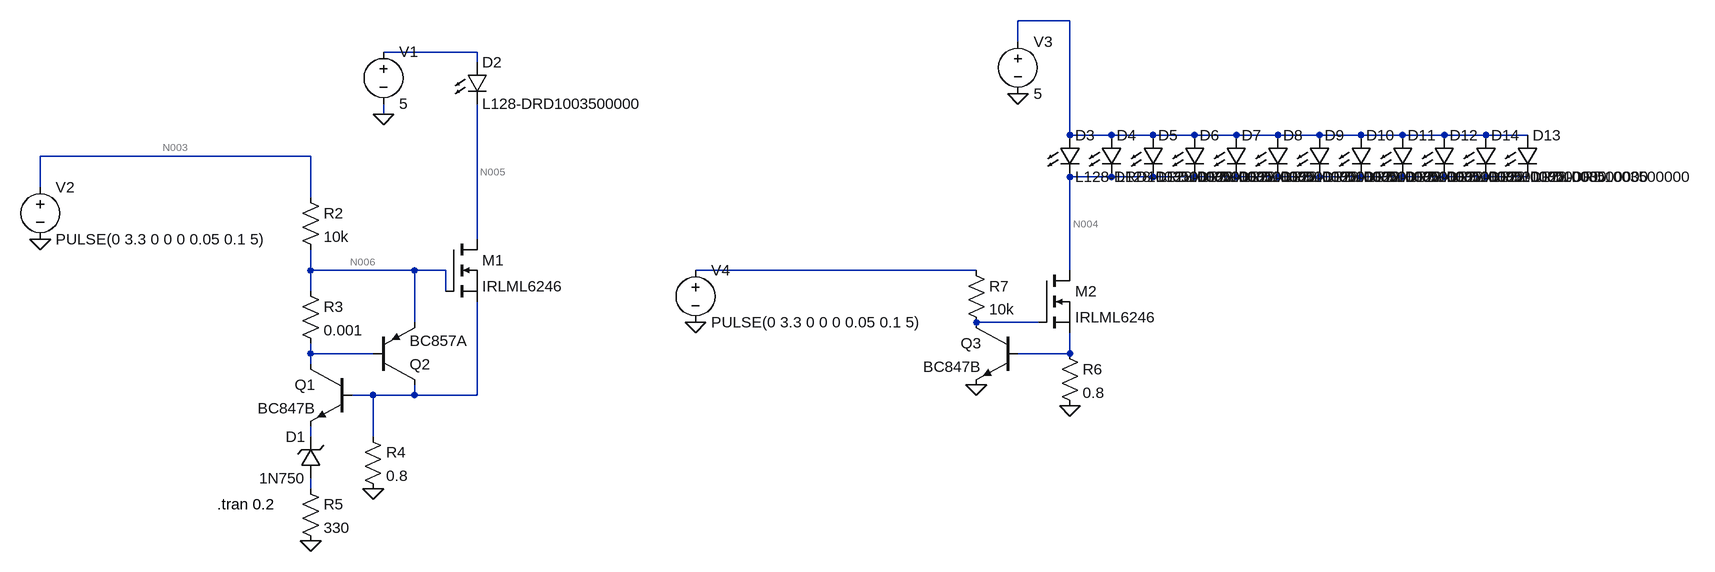
[diagram p0: schematic MOSFET.asc]
MOSFET.asc, the LTspice schematic file:
Version 4
SHEET 1 2644 680
WIRE 1408 -512 1328 -512
WIRE 1328 -480 1328 -512
WIRE 496 -464 352 -464
WIRE 496 -448 496 -464
WIRE 352 -368 352 -384
WIRE 1408 -336 1408 -512
WIRE 1472 -336 1408 -336
WIRE 1536 -336 1472 -336
WIRE 1600 -336 1536 -336
WIRE 1664 -336 1600 -336
WIRE 1728 -336 1664 -336
WIRE 1792 -336 1728 -336
WIRE 1856 -336 1792 -336
WIRE 1920 -336 1856 -336
WIRE 1984 -336 1920 -336
WIRE 2048 -336 1984 -336
WIRE 2112 -336 2048 -336
WIRE 240 -304 -176 -304
WIRE 1472 -272 1408 -272
WIRE 1536 -272 1472 -272
WIRE 1600 -272 1536 -272
WIRE 1664 -272 1600 -272
WIRE 1728 -272 1664 -272
WIRE 1792 -272 1728 -272
WIRE 1856 -272 1792 -272
WIRE 1920 -272 1856 -272
WIRE 1984 -272 1920 -272
WIRE 2048 -272 1984 -272
WIRE 2112 -272 2048 -272
WIRE -176 -256 -176 -304
WIRE 240 -240 240 -304
WIRE 496 -176 496 -384
WIRE 240 -128 240 -160
WIRE 400 -128 240 -128
WIRE 448 -128 400 -128
WIRE 1264 -128 832 -128
WIRE 1408 -128 1408 -272
WIRE 240 -96 240 -128
WIRE 448 -96 448 -128
WIRE 400 -48 400 -128
WIRE 1360 -48 1264 -48
WIRE 240 0 240 -16
WIRE 336 0 240 0
WIRE 1408 0 1408 -32
WIRE 1408 0 1328 0
WIRE 240 16 240 0
WIRE 336 64 304 64
WIRE 400 64 400 48
WIRE 400 64 336 64
WIRE 496 64 496 -80
WIRE 496 64 400 64
WIRE 240 128 240 112
WIRE 336 128 336 64
WIRE 240 208 240 192
FLAG 352 -368 0
FLAG -176 -176 0
FLAG 336 208 0
FLAG 240 288 0
FLAG 1328 -400 0
FLAG 1408 80 0
FLAG 1264 48 0
FLAG 832 -48 0
SYMBOL npn 304 16 M0
SYMATTR InstName Q1
SYMATTR Value BC847B
SYMBOL pnp 336 48 M180
SYMATTR InstName Q2
SYMATTR Value BC857A
SYMBOL nmos 448 -176 R0
SYMATTR InstName M1
SYMATTR Value IRLML6246
SYMBOL res 224 -256 R0
SYMATTR InstName R2
SYMATTR Value 10k
SYMATTR SpiceLine tol=1
SYMBOL res 224 -112 R0
SYMATTR InstName R3
SYMATTR Value 0.001
SYMATTR SpiceLine tol=1
SYMBOL res 320 112 R0
SYMATTR InstName R4
SYMATTR Value 0.8
SYMATTR SpiceLine tol=1
SYMBOL voltage 352 -480 R0
WINDOW 123 0 0 Left 0
WINDOW 39 0 0 Left 0
SYMATTR InstName V1
SYMATTR Value 5
SYMBOL voltage -176 -272 R0
WINDOW 123 0 0 Left 0
WINDOW 39 0 0 Left 0
SYMATTR InstName V2
SYMATTR Value PULSE(0 3.3 0 0 0 0.05 0.1 5)
SYMBOL res 224 192 R0
SYMATTR InstName R5
SYMATTR Value 330
SYMATTR SpiceLine tol=1
SYMBOL voltage 1328 -496 R0
WINDOW 123 0 0 Left 0
WINDOW 39 0 0 Left 0
SYMATTR InstName V3
SYMATTR Value 5
SYMBOL voltage 832 -144 R0
WINDOW 123 0 0 Left 0
WINDOW 39 0 0 Left 0
SYMATTR InstName V4
SYMATTR Value PULSE(0 3.3 0 0 0 0.05 0.1 5)
SYMBOL nmos 1360 -128 R0
SYMATTR InstName M2
SYMATTR Value IRLML6246
SYMBOL npn 1328 -48 M0
SYMATTR InstName Q3
SYMATTR Value BC847B
SYMBOL res 1392 -16 R0
SYMATTR InstName R6
SYMATTR Value 0.8
SYMATTR SpiceLine tol=5
SYMBOL res 1248 -144 R0
SYMATTR InstName R7
SYMATTR Value 10k
SYMATTR SpiceLine tol=1
SYMBOL LED 1392 -336 R0
SYMATTR InstName D3
SYMATTR Value L128-DRD1003500000
SYMATTR Description Diode
SYMATTR Type diode
SYMBOL LED 1456 -336 R0
SYMATTR InstName D4
SYMATTR Value L128-DRD1003500000
SYMATTR Description Diode
SYMATTR Type diode
SYMBOL LED 1520 -336 R0
SYMATTR InstName D5
SYMATTR Value L128-DRD1003500000
SYMATTR Description Diode
SYMATTR Type diode
SYMBOL LED 1584 -336 R0
SYMATTR InstName D6
SYMATTR Value L128-DRD1003500000
SYMATTR Description Diode
SYMATTR Type diode
SYMBOL LED 1648 -336 R0
SYMATTR InstName D7
SYMATTR Value L128-DRD1003500000
SYMATTR Description Diode
SYMATTR Type diode
SYMBOL LED 1712 -336 R0
SYMATTR InstName D8
SYMATTR Value L128-DRD1003500000
SYMATTR Description Diode
SYMATTR Type diode
SYMBOL LED 1776 -336 R0
SYMATTR InstName D9
SYMATTR Value L128-DRD1003500000
SYMATTR Description Diode
SYMATTR Type diode
SYMBOL LED 1840 -336 R0
SYMATTR InstName D10
SYMATTR Value L128-DRD1003500000
SYMATTR Description Diode
SYMATTR Type diode
SYMBOL LED 1904 -336 R0
SYMATTR InstName D11
SYMATTR Value L128-DRD1003500000
SYMATTR Description Diode
SYMATTR Type diode
SYMBOL LED 1968 -336 R0
SYMATTR InstName D12
SYMATTR Value L128-DRD1003500000
SYMATTR Description Diode
SYMATTR Type diode
SYMBOL LED 2096 -336 R0
SYMATTR InstName D13
SYMATTR Value L128-DRD1003500000
SYMATTR Description Diode
SYMATTR Type diode
SYMBOL zener 256 192 R180
WINDOW 0 24 64 Left 2
WINDOW 3 24 0 Left 2
SYMATTR InstName D1
SYMATTR Value 1N750
SYMBOL LED 480 -448 R0
SYMATTR InstName D2
SYMATTR Value L128-DRD1003500000
SYMATTR Description Diode
SYMATTR Type diode
SYMBOL LED 2032 -336 R0
SYMATTR InstName D14
SYMATTR Value L128-DRD1003500000
SYMATTR Description Diode
SYMATTR Type diode
TEXT 96 232 Left 2 !.tran 0.2

The netlist it stands for:
* MOSFET.asc
Q1 N009 N011 N012 0 BC847B
Q2 N011 N009 N006 0 BC857A
M1 N005 N006 N011 N011 IRLML6246
R2 N003 N006 10k tol=1
R3 N006 N009 0.001 tol=1
R4 N011 0 0.8 tol=1
V1 N002 0 5
V2 N003 0 PULSE(0 3.3 0 0 0 0.05 0.1 5)
R5 N013 0 330 tol=1
V3 N001 0 5
V4 N007 0 PULSE(0 3.3 0 0 0 0.05 0.1 5)
M2 N004 N008 N010 N010 IRLML6246
Q3 N008 N010 0 0 BC847B
R6 N010 0 0.8 tol=5
R7 N007 N008 10k tol=1
D3 N001 N004 L128-DRD1003500000
D4 N001 N004 L128-DRD1003500000
D5 N001 N004 L128-DRD1003500000
D6 N001 N004 L128-DRD1003500000
D7 N001 N004 L128-DRD1003500000
D8 N001 N004 L128-DRD1003500000
D9 N001 N004 L128-DRD1003500000
D10 N001 N004 L128-DRD1003500000
D11 N001 N004 L128-DRD1003500000
D12 N001 N004 L128-DRD1003500000
D13 N001 N004 L128-DRD1003500000
D1 N013 N012 1N750
D2 N002 N005 L128-DRD1003500000
D14 N001 N004 L128-DRD1003500000
.model D D
.lib standard.dio
.model NPN NPN
.model PNP PNP
.lib standard.bjt
.model NMOS NMOS
.model PMOS PMOS
.lib standard.mos
.tran 0.2
.backanno
.end

* Results of the author's LTspice run, read from the files saved beside the schematic
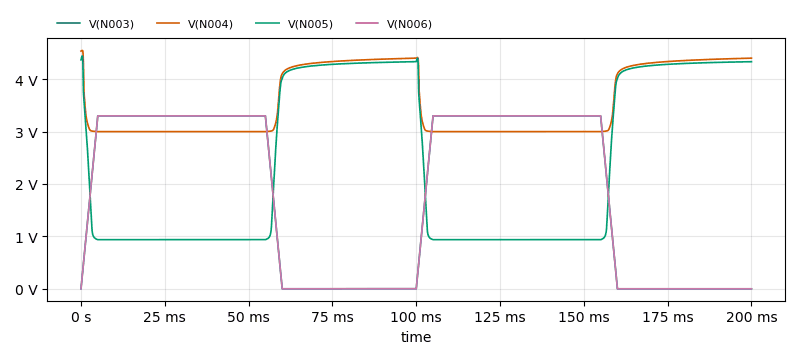
[diagram p1: Transient Analysis of MOSFET.asc, plotted from the saved traces]
* Transient Analysis, 1 run:
*   V(N003): min 0 V, max 3.3 V, average 1.815 V, rms 2.41 V, last 0 V
*   V(N004): min 2.999 V, max 4.549 V, average 3.565 V, rms 3.624 V, last 4.401 V
*   V(N005): min 937.1 mV, max 4.443 V, average 2.402 V, rms 2.898 V, last 4.333 V
*   V(N006): min 0 V, max 3.3 V, average 1.815 V, rms 2.41 V, last 950.8 nV